# EAGLE design tempeh_NoHat (EAGLE 9.4.2)
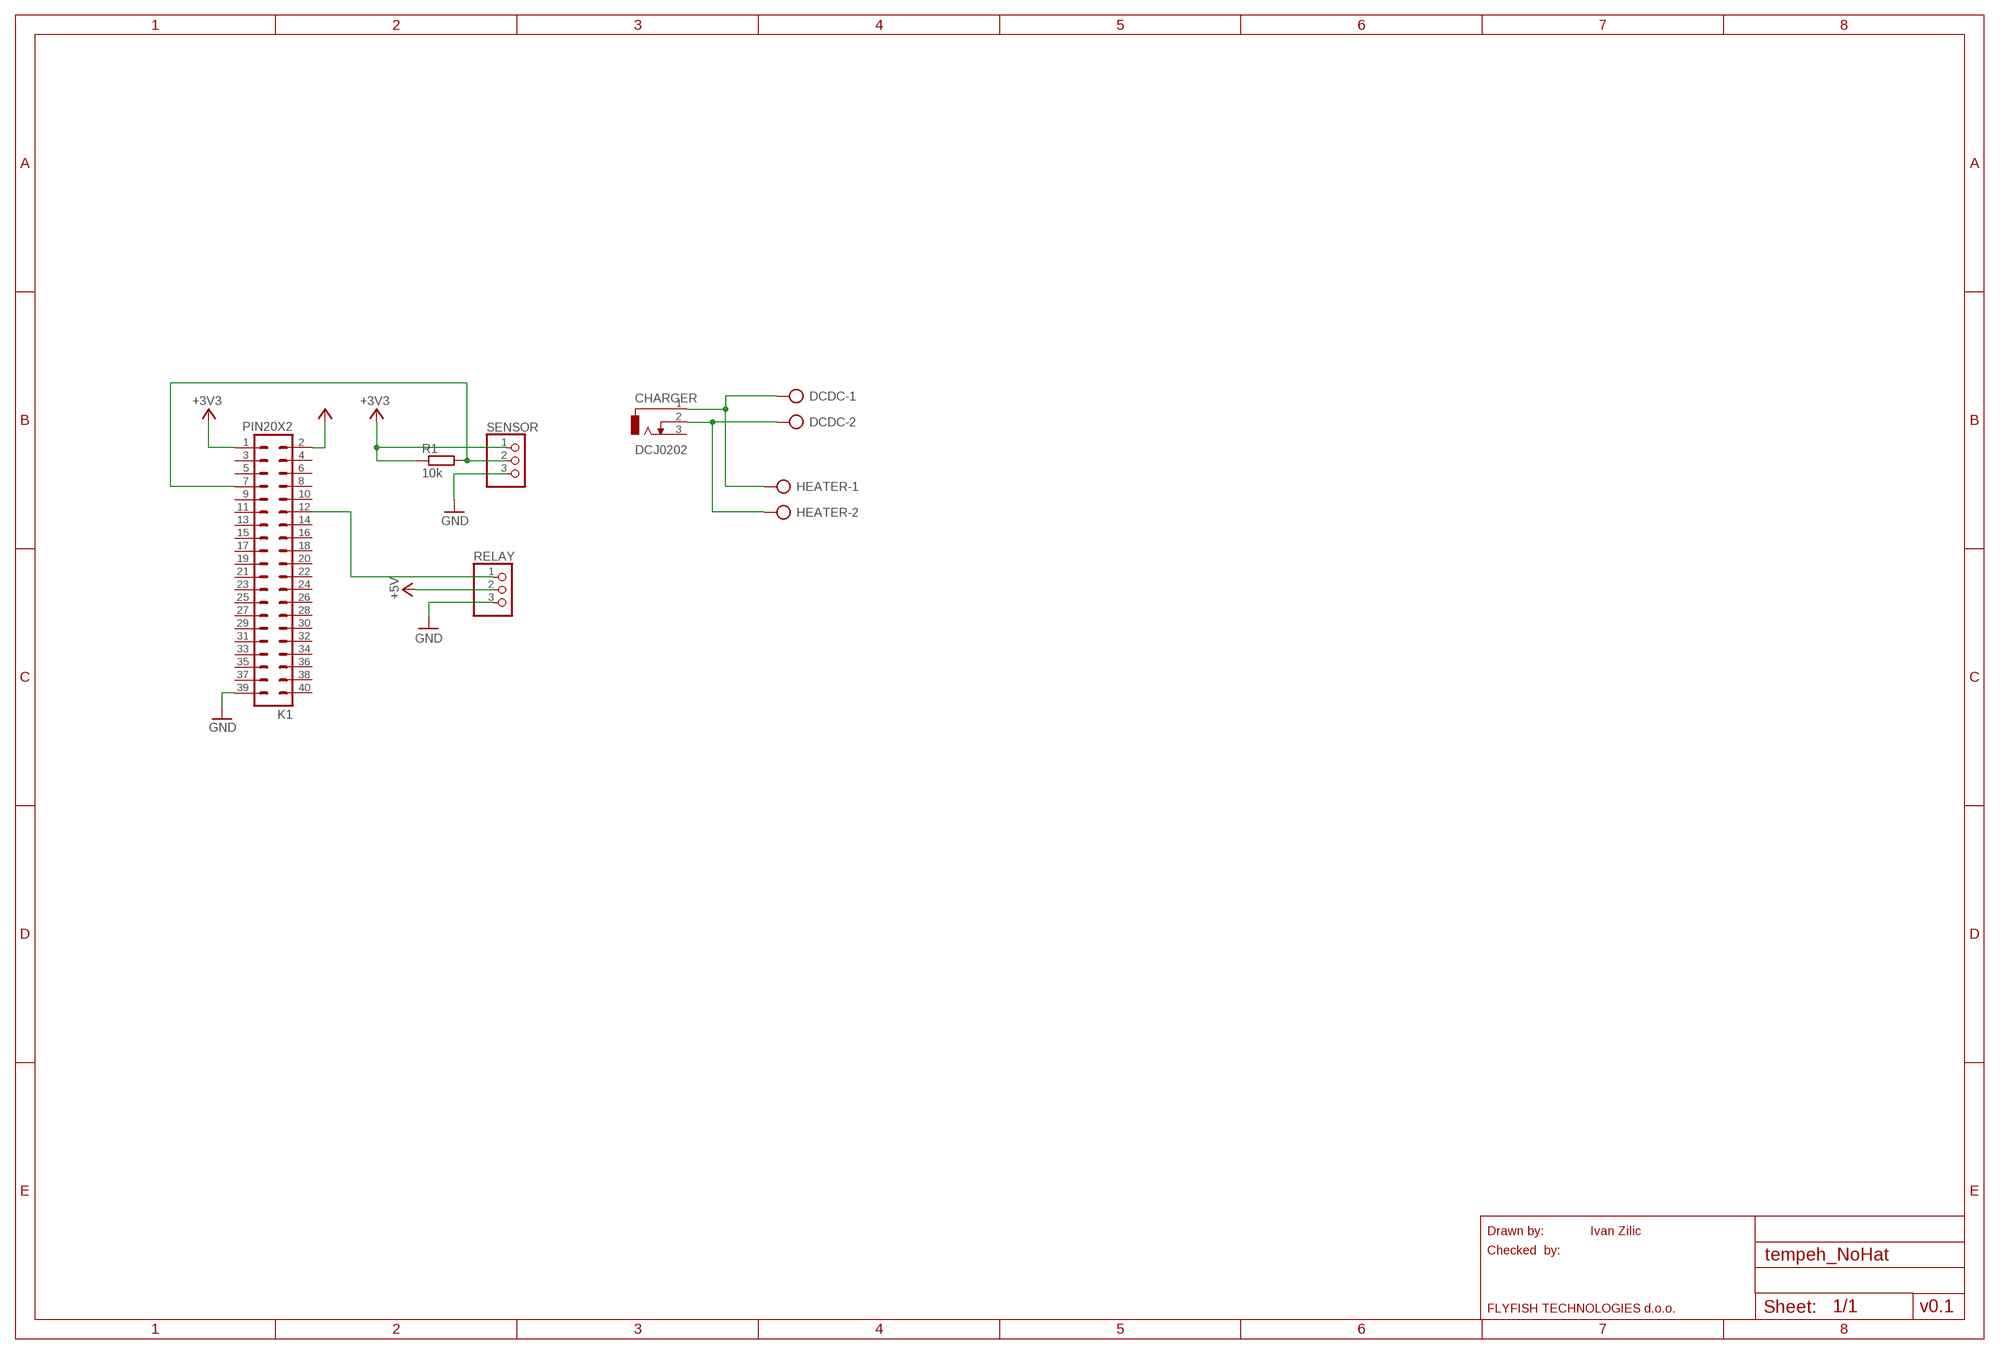
[diagram p0: schematic, sheet 1]

## Parts
CHARGER  DCJ0202  [DCJ0202]
DCDC  AK300/2  [AK300/2]
HEATER  AK300/2  [AK300/2]
K1  PIN20X2  [PIN_20X2]
R1  10k  R-EU_0204/7  [0204/7]
RELAY  PINHD-1X3  [1X03]
SENSOR  PINHD-1X3  [1X03]

## Nets
+3V3: K1.1 R1.1 SENSOR.1
+5V: K1.2 RELAY.2
GND: K1.39 RELAY.3 SENSOR.3
N$1: K1.7 R1.2 SENSOR.2
N$2: K1.12 RELAY.1
N$5: CHARGER.1 DCDC.1 HEATER.1
N$6: CHARGER.2 DCDC.2 HEATER.2
Unconnected: CHARGER.3 K1.3 K1.4 K1.5 K1.6 K1.8 K1.9 K1.10 K1.11 K1.13 K1.14 K1.15 K1.16 K1.17 K1.18 K1.19 K1.20 K1.21 K1.22 K1.23 K1.24 K1.25 K1.26 K1.27 K1.28 K1.29 K1.30 K1.31 K1.32 K1.33 K1.34 K1.35 K1.36 K1.37 K1.38 K1.40

## Notes on the sheet
- Drawn by: | Ivan Zilic
- Checked  by:
- FLYFISH TECHNOLOGIES d.o.o. | v0.1

## Library data of the parts
CHARGER = con-jack:DCJ0202: DC POWER JACK Source: DCJ0202.pdf; OC_FARNELL: unknown; OC_NEWARK: unknown
DCDC HEATER = con-ptr500:AK300/2: CONNECTOR; OC_FARNELL: unknown; OC_NEWARK: unknown
K1 = FLYFISH:PIN20X2
R1 = rcl:R-EU_: RESISTOR, European symbol; SPICEPREFIX: R
RELAY SENSOR = pinhead:PINHD-1X3: PIN HEADER

## Net classes
0 default: width 0.305 mm, drill 0.508 mm, clearance 0.254 mm

## Board
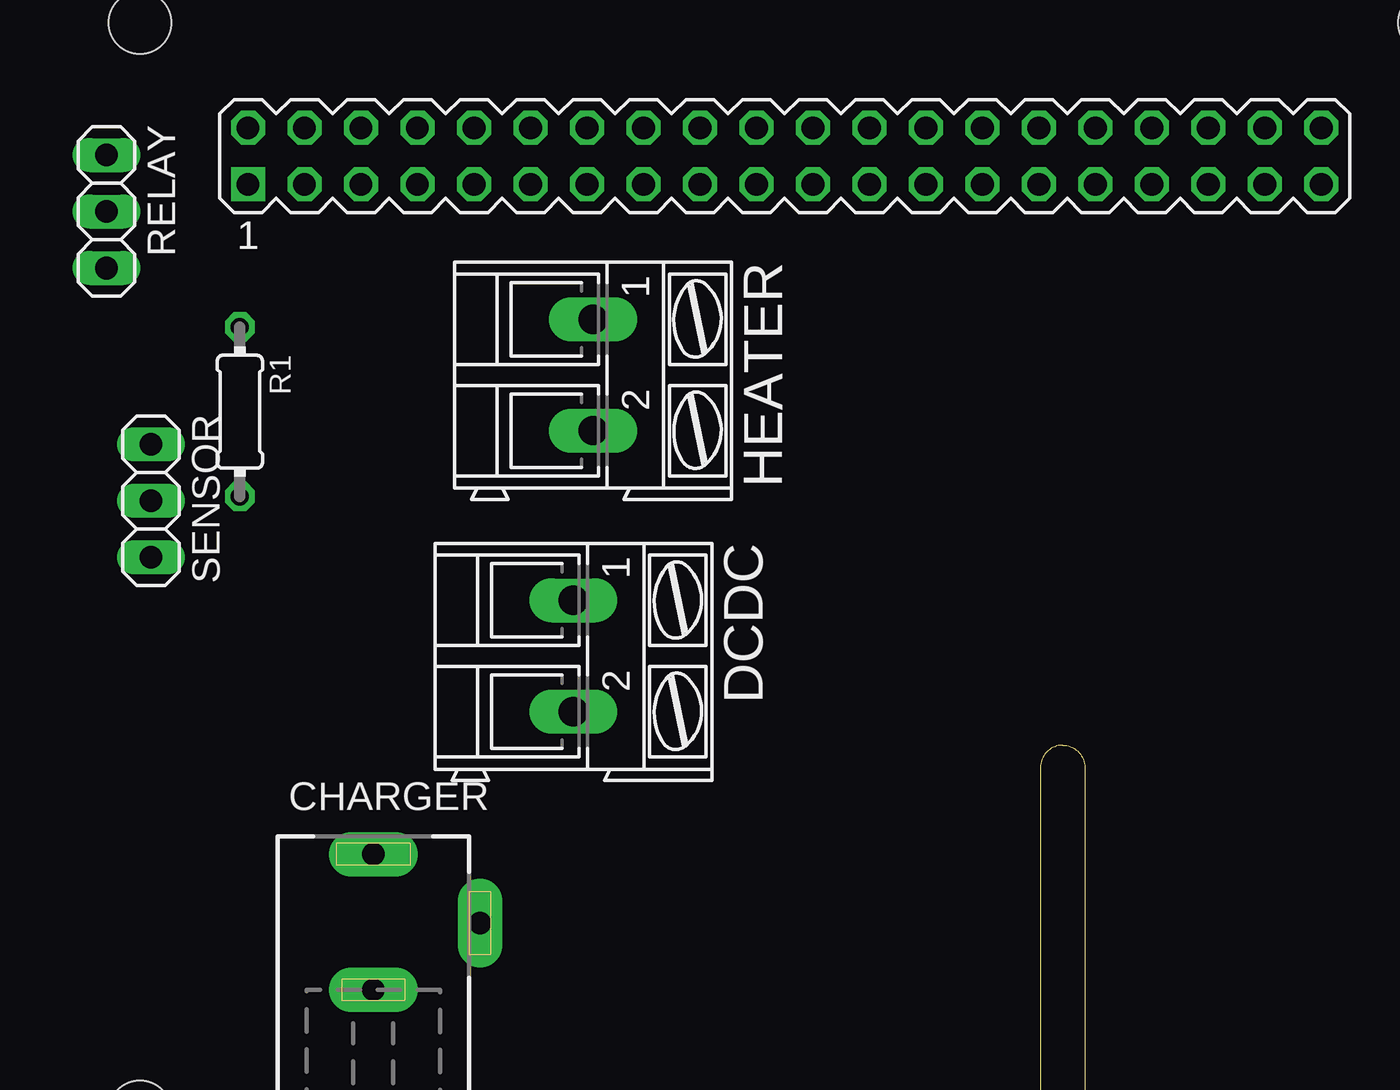
[diagram p1: board, top side]
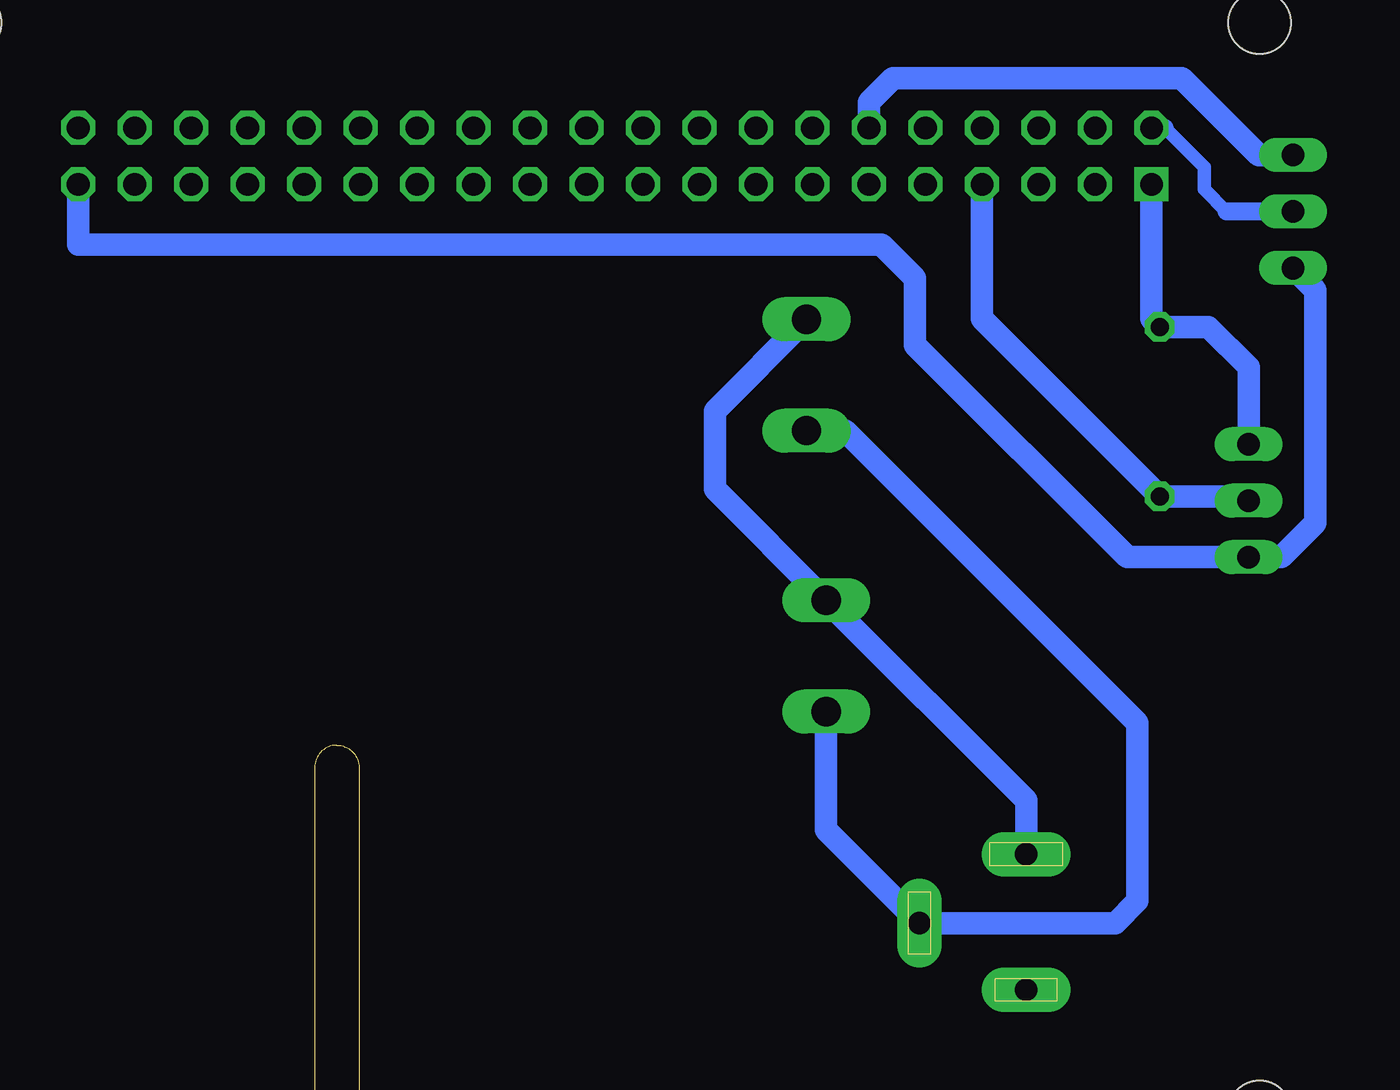
[diagram p2: board, bottom side, seen from below]

No outline drawn. Coordinates in mm, seen from the top.
Copper layers (1*16): Top 0.035mm / dielectric 1.5mm / Bottom 0.035mm
Design rules "ITEADstudio_DRC": minimum track width 6mil, minimum drill 12mil, track to track 6mil, track to pad 6mil, pad to pad 6mil, via to via 6mil, smd to smd 0mil, copper to edge 10mil, drill to drill 10mil, minimum pad ring 10mil, minimum via ring 6mil, stop-mask expansion 2mil, vias tented up to drill 100mil, thermal gap 10mil
Holes 2.8 mm at 3.5,3.5 3.5,52.5 61.5,52.5 61.5,3.5
tRestrict: area 1.9,51 to 5,54; area 60,51 to 63,54; area 60,1.9 to 63,5; area 1.9,1.9 to 5,5
bRestrict: area 1.9,1.9 to 5,5; area 1.9,51 to 5,54; area 60,1.9 to 63,5; area 60,51 to 63,54
Milling: 6 lines

### Footprints (pad centres in the part's own frame; a part is rotated, then mirrored left to right if it is on the bottom)
DCJ0202 = drill 1 pad 2 long: 1 0,3.1; 2 4.8,0; 3 0,-3
AK300/2 = drill 1.321 long: 1 -2.515,0; 2 2.489,0
PIN_20X2 = drill 1.016 square: 1 -24.13,-1.27 | drill 1.016 octagon: 2 -24.13,1.27; 3 -21.59,-1.27; 4 -21.59,1.27; 5 -19.05,-1.27; 6 -19.05,1.27; 7 -16.51,-1.27; 8 -16.51,1.27; 9 -13.97,-1.27; 10 -13.97,1.27; 11 -11.43,-1.27; 12 -11.43,1.27; 13 -8.89,-1.27; 14 -8.89,1.27; 15 -6.35,-1.27; 16 -6.35,1.27; 17 -3.81,-1.27; 18 -3.81,1.27; 19 -1.27,-1.27; 20 -1.27,1.27; 21 1.27,-1.27; 22 1.27,1.27; 23 3.81,-1.27; 24 3.81,1.27; 25 6.35,-1.27; 26 6.35,1.27; 27 8.89,-1.27; 28 8.89,1.27; 29 11.43,-1.27; 30 11.43,1.27; 31 13.97,-1.27; 32 13.97,1.27; 33 16.51,-1.27; 34 16.51,1.27; 35 19.05,-1.27; 36 19.05,1.27; 37 21.59,-1.27; 38 21.59,1.27; 39 24.13,-1.27; 40 24.13,1.27
0204/7 = drill 0.813 octagon: 1 -3.81,0; 2 3.81,0
1X03 = drill 1.016 long: 1 -2.54,0; 2 0,0; 3 2.54,0

### Placement (x,y rotation side)
CHARGER  14,12 0 top
DCDC  23,24 270 top
HEATER  23.88,36.64 270 top
K1  32.5,46.5 0 top
R1  8,35 270 top
RELAY  2,44 270 top
SENSOR  4,31 270 top

### Tracks (layer width: path | path; a pad name or v marks a point on that pad's centre or on a via)
+3V3
  Bottom 1.016: SENSOR.1 4,37 5.81,38.81 R1.1 8.37,39.18 K1.1
+5V
  Bottom 0.61: 5,44 6,45 6,46 7.77,47.77
  Bottom 0.813: RELAY.2 5,44 | 7.77,47.77 K1.2
GND
  Bottom 1.016: RELAY.3 1,40.46 1,30 2.54,28.46 SENSOR.3 9.46,28.46 19,38 19,41 20.51,42.51 56.63,42.51 K1.39
N$1
  Bottom 1.016: SENSOR.2 4.19,31.19 R1.2 15.99,39.18 K1.7
N$2
  Bottom 1.016: RELAY.1 3.54,46.54 7,50 20,50 21.07,48.93 K1.12
N$5
  Bottom 1.016: HEATER.1 28,35.03 28,31.52 DCDC.1 14,17.52 CHARGER.1
N$6
  Bottom 1.016: DCDC.2 23,16.2 CHARGER.2 10,12 9,13 9,21 22.15,34.15 HEATER.2